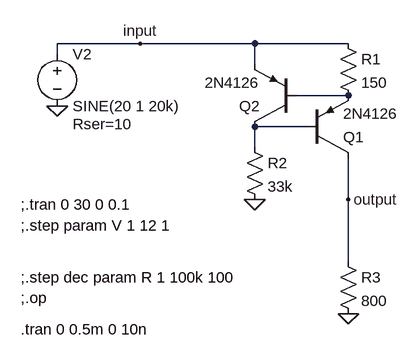
[diagram p0: schematic current_source.asc]
current_source.asc, the LTspice schematic file:
Version 4
SHEET 1 880 680
WIRE -32 -16 -160 -16
WIRE 144 -16 -32 -16
WIRE 288 -16 144 -16
WIRE -160 0 -160 -16
WIRE 144 16 144 -16
WIRE 288 64 208 64
WIRE 224 112 144 112
WIRE 144 144 144 112
WIRE 288 224 288 160
WIRE 288 320 288 224
FLAG 288 400 0
FLAG 144 224 0
FLAG -32 -16 input
FLAG 288 224 output
FLAG -160 80 0
SYMBOL res 272 304 R0
SYMATTR InstName R3
SYMATTR Value 800
SYMBOL res 272 -32 R0
SYMATTR InstName R1
SYMATTR Value 150
SYMBOL pnp 224 160 M180
SYMATTR InstName Q1
SYMATTR Value 2N4126
SYMBOL pnp 208 112 R180
SYMATTR InstName Q2
SYMATTR Value 2N4126
SYMBOL res 128 128 R0
SYMATTR InstName R2
SYMATTR Value 33k
SYMBOL voltage -160 -16 R0
WINDOW 123 0 0 Left 0
WINDOW 39 24 124 Left 2
SYMATTR SpiceLine Rser=10
SYMATTR InstName V2
SYMATTR Value SINE(20 1 20k)
TEXT -216 344 Left 2 !;.step dec param R 1 100k 100
TEXT -216 376 Left 2 !;.op
TEXT -216 232 Left 2 !;.tran 0 30 0 0.1
TEXT -216 264 Left 2 !;.step param V 1 12 1
TEXT -216 424 Left 2 !.tran 0 0.5m 0 10n

The netlist it stands for:
* current_source.asc
R3 output 0 800
R1 input N001 150
Q1 output N002 N001 0 2N4126
Q2 N002 N001 input 0 2N4126
R2 N002 0 33k
V2 input 0 SINE(20 1 20k) Rser=10
.model NPN NPN
.model PNP PNP
.lib standard.bjt
;.step dec param R 1 100k 100
;.op
;.tran 0 30 0 0.1
;.step param V 1 12 1
.tran 0 0.5m 0 10n
.backanno
.end